# EasyEDA schematic EASYEDA_SCH_WaterLevelAtmega328_2022-11-29.json
TITLE: Sheet_1; REV: 1.0; Date: 2022-09-16; Sheet: 1/1; Drawn By: COB RCE; Company: Your Company
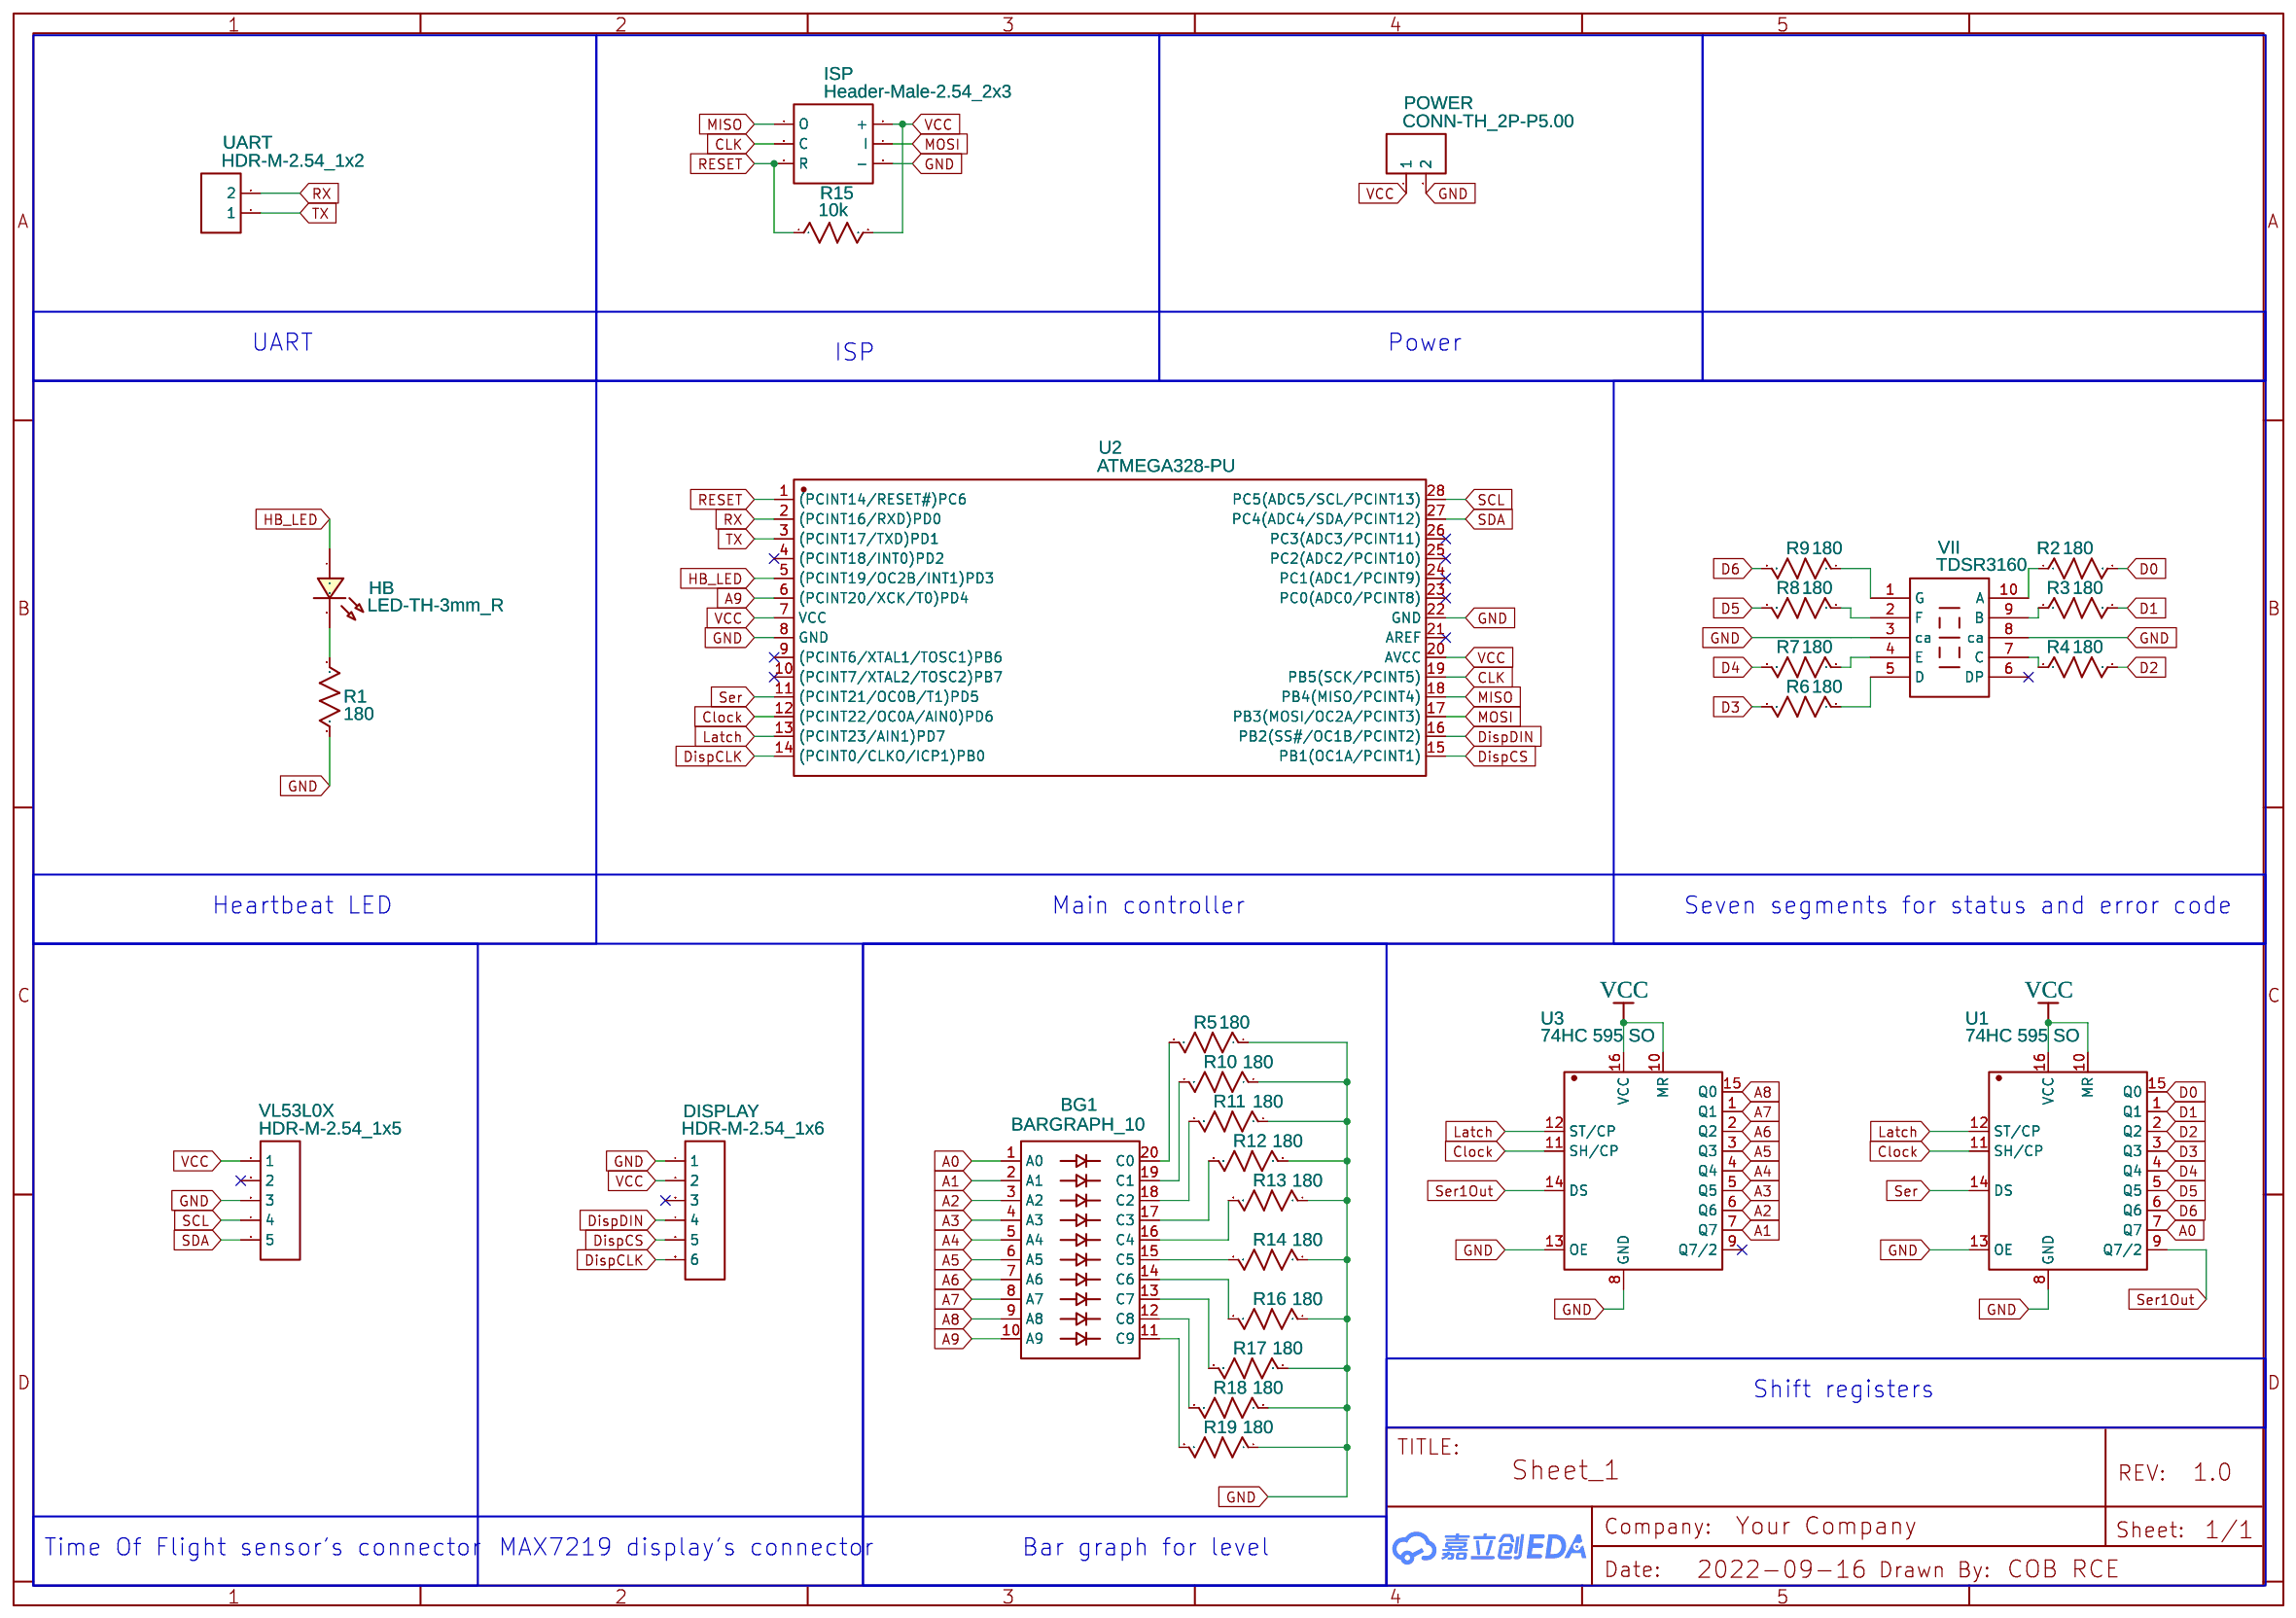
[diagram p0: schematic sheet]

## Parts
BG1  BARGRAPH_10  [BARGRAPH_10]
DISPLAY  HDR-M-2.54_1x6  [HDR-M-2.54_1X6]
HB  LED-TH-3mm_R  [LED-TH_BD3.0_RED]
ISP  Header-Male-2.54_2x3  [HDR-TH_6PIN-V-ROW2-COL3-MALE-PITCH2.54]
POWER  CONN-TH_2P-P5.00  [CONN-TH_2P-P5.00]
R1  180  [AXIAL-0.3]
R2  180  [AXIAL-0.3]
R3  180  [AXIAL-0.3]
R4  180  [AXIAL-0.3]
R5  180  [AXIAL-0.3]
R6  180  [AXIAL-0.3]
R7  180  [AXIAL-0.3]
R8  180  [AXIAL-0.3]
R9  180  [AXIAL-0.3]
R10  180  [AXIAL-0.3]
R11  180  [AXIAL-0.3]
R12  180  [AXIAL-0.3]
R13  180  [AXIAL-0.3]
R14  180  [AXIAL-0.3]
R15  10k  [AXIAL-0.3]
R16  180  [AXIAL-0.3]
R17  180  [AXIAL-0.3]
R18  180  [AXIAL-0.3]
R19  180  [AXIAL-0.3]
U1  74HC 595 SO  [74HC595]
U2  ATMEGA328-PU  [DIP-28_L35.0-W6.5-P2.54-LS7.6-BL]
U3  74HC 595 SO  [74HC595]
UART  HDR-M-2.54_1x2  [HDR-M-2.54_1X2]
VII  TDSR3160  [TDSR3160]
VL53L0X  HDR-M-2.54_1x5  [HDR-M-2.54_1X5]

## Library data of the parts
BG1 = BARGRAPH_10: Contributor: Serotonindude
DISPLAY = HDR-M-2.54_1x6: Supplier Part: C190819; Supplier: LCSC; Contributor: LCEDA_Lib
HB = LED-TH-3mm_R: Manufacturer: EVERLIGHT(台湾亿光); Manufacturer Part: 204-10SDRD/S530-A3-L; Supplier Part: C84774; Supplier: LCSC; Contributor: LCEDA_Lib
ISP = -: Supplier: LCSC; Manufacturer: BOOMELE; Supplier Part: C65114
POWER = CONN-TH_2P-P5.00: Supplier: LCSC; Contributor: LCEDA_Lib
R1-R19 = Res_AXIAL-0.3(1/8W)_US: Manufacturer Part: ?
U1 U3 = -: Supplier Part: C110383; Supplier: LCSC; Manufacturer: KVDB; Manufacturer Part: 74HC595A; Contributor: KVDB
U2 = ATMEGA328-PU: Supplier: LCSC; Supplier Part: C613508; Manufacturer: MICROCHIP(美国微芯); Contributor: LCSC; JLCPCB Part Class: Extended Part
UART = HDR-M-2.54_1x2: Supplier Part: C124375; Supplier: LCSC; Contributor: LCEDA_Lib
VII = TDSR3160: Manufacturer: VISHAY; Contributor: hisoka
VL53L0X = HDR-M-2.54_1x5: Supplier Part: C358687; Supplier: LCSC; Contributor: LCEDA_Lib

## Nets
GND: DISPLAY.1 ISP.6(-) POWER.2 R1.2 R5.1 R10.1 R11.1 R12.1 R13.1 R14.1 R16.1 R17.1 R18.1 R19.1 U1.8(GND) U1.13(OE) U2.8(GND) U2.22(GND) U3.8(GND) U3.13(OE) VII.3(ca) VII.8(ca) VL53L0X.3
VCC: DISPLAY.2 ISP.2(+) POWER.1 R15.2 U1.10(MR) U1.16(VCC) U2.7(VCC) U2.20(AVCC) U3.10(MR) U3.16(VCC) VL53L0X.1
A0: BG1.1(A0) U1.7(Q7)
A1: BG1.2(A1) U3.7(Q7)
A2: BG1.3(A2) U3.6(Q6)
A3: BG1.4(A3) U3.5(Q5)
A4: BG1.5(A4) U3.4(Q4)
A5: BG1.6(A5) U3.3(Q3)
A6: BG1.7(A6) U3.2(Q2)
A7: BG1.8(A7) U3.1(Q1)
A8: BG1.9(A8) U3.15(Q0)
A9: BG1.10(A9) U2.6((PCINT20/XCK/T0)PD4)
CLK: ISP.3(C) U2.19(PB5(SCK/PCINT5))
Clock: U1.11(SH/CP) U2.12((PCINT22/OC0A/AIN0)PD6) U3.11(SH/CP)
D0: R2.2 U1.15(Q0)
D1: R3.2 U1.1(Q1)
D2: R4.2 U1.2(Q2)
D3: R6.2 U1.3(Q3)
D4: R7.2 U1.4(Q4)
D5: R8.2 U1.5(Q5)
D6: R9.2 U1.6(Q6)
DispCLK: DISPLAY.6 U2.14((PCINT0/CLKO/ICP1)PB0)
DispCS: DISPLAY.5 U2.15(PB1(OC1A/PCINT1))
DispDIN: DISPLAY.4 U2.16(PB2(SS#/OC1B/PCINT2))
HB_LED: HB.1 U2.5((PCINT19/OC2B/INT1)PD3)
Latch: U1.12(ST/CP) U2.13((PCINT23/AIN1)PD7) U3.12(ST/CP)
MISO: ISP.1(O) U2.18(PB4(MISO/PCINT4))
MOSI: ISP.4(I) U2.17(PB3(MOSI/OC2A/PCINT3))
RESET: ISP.5(R) R15.1 U2.1((PCINT14/RESET#)PC6)
RX: U2.2((PCINT16/RXD)PD0) UART.2
SCL: U2.28(PC5(ADC5/SCL/PCINT13)) VL53L0X.4
SDA: U2.27(PC4(ADC4/SDA/PCINT12)) VL53L0X.5
Ser: U1.14(DS) U2.11((PCINT21/OC0B/T1)PD5)
Ser1Out: U1.9(Q7/2) U3.14(DS)
TX: U2.3((PCINT17/TXD)PD1) UART.1
Net-(BG1-11): BG1.11(C9) R19.2
Net-(BG1-12): BG1.12(C8) R18.2
Net-(BG1-13): BG1.13(C7) R17.2
Net-(BG1-14): BG1.14(C6) R16.2
Net-(BG1-15): BG1.15(C5) R14.2
Net-(BG1-16): BG1.16(C4) R13.2
Net-(BG1-17): BG1.17(C3) R12.2
Net-(BG1-18): BG1.18(C2) R11.2
Net-(BG1-19): BG1.19(C1) R10.2
Net-(BG1-20): BG1.20(C0) R5.2
Net-(HB-2): HB.2 R1.1
Net-(R2-1): R2.1 VII.10(A)
Net-(R3-1): R3.1 VII.9(B)
Net-(R4-1): R4.1 VII.7(C)
Net-(R6-1): R6.1 VII.5(D)
Net-(R7-1): R7.1 VII.4(E)
Net-(R8-1): R8.1 VII.2(F)
Net-(R9-1): R9.1 VII.1(G)

Not connected (* = marked no-connect by the designer): DISPLAY 3*; U2 4((PCINT18/INT0)PD2)* 9((PCINT6/XTAL1/TOSC1)PB6)* 10((PCINT7/XTAL2/TOSC2)PB7)* 21(AREF)* 23(PC0(ADC0/PCINT8))* 24(PC1(ADC1/PCINT9))* 25(PC2(ADC2/PCINT10))* 26(PC3(ADC3/PCINT11))*; U3 9(Q7/2)*; VII 6(DP)*; VL53L0X 2*

## Notes on the sheet
- UART
- ISP
- Power
- Heartbeat LED
- Main controller
- Seven segments for status and error code
- Shift registers
- Time Of Flight sensor's connector
- MAX7219 display's connector
- Bar graph for level
